# Altium schematic sheet ISL6236A_DEMO.SchDoc (part 2 of 2)
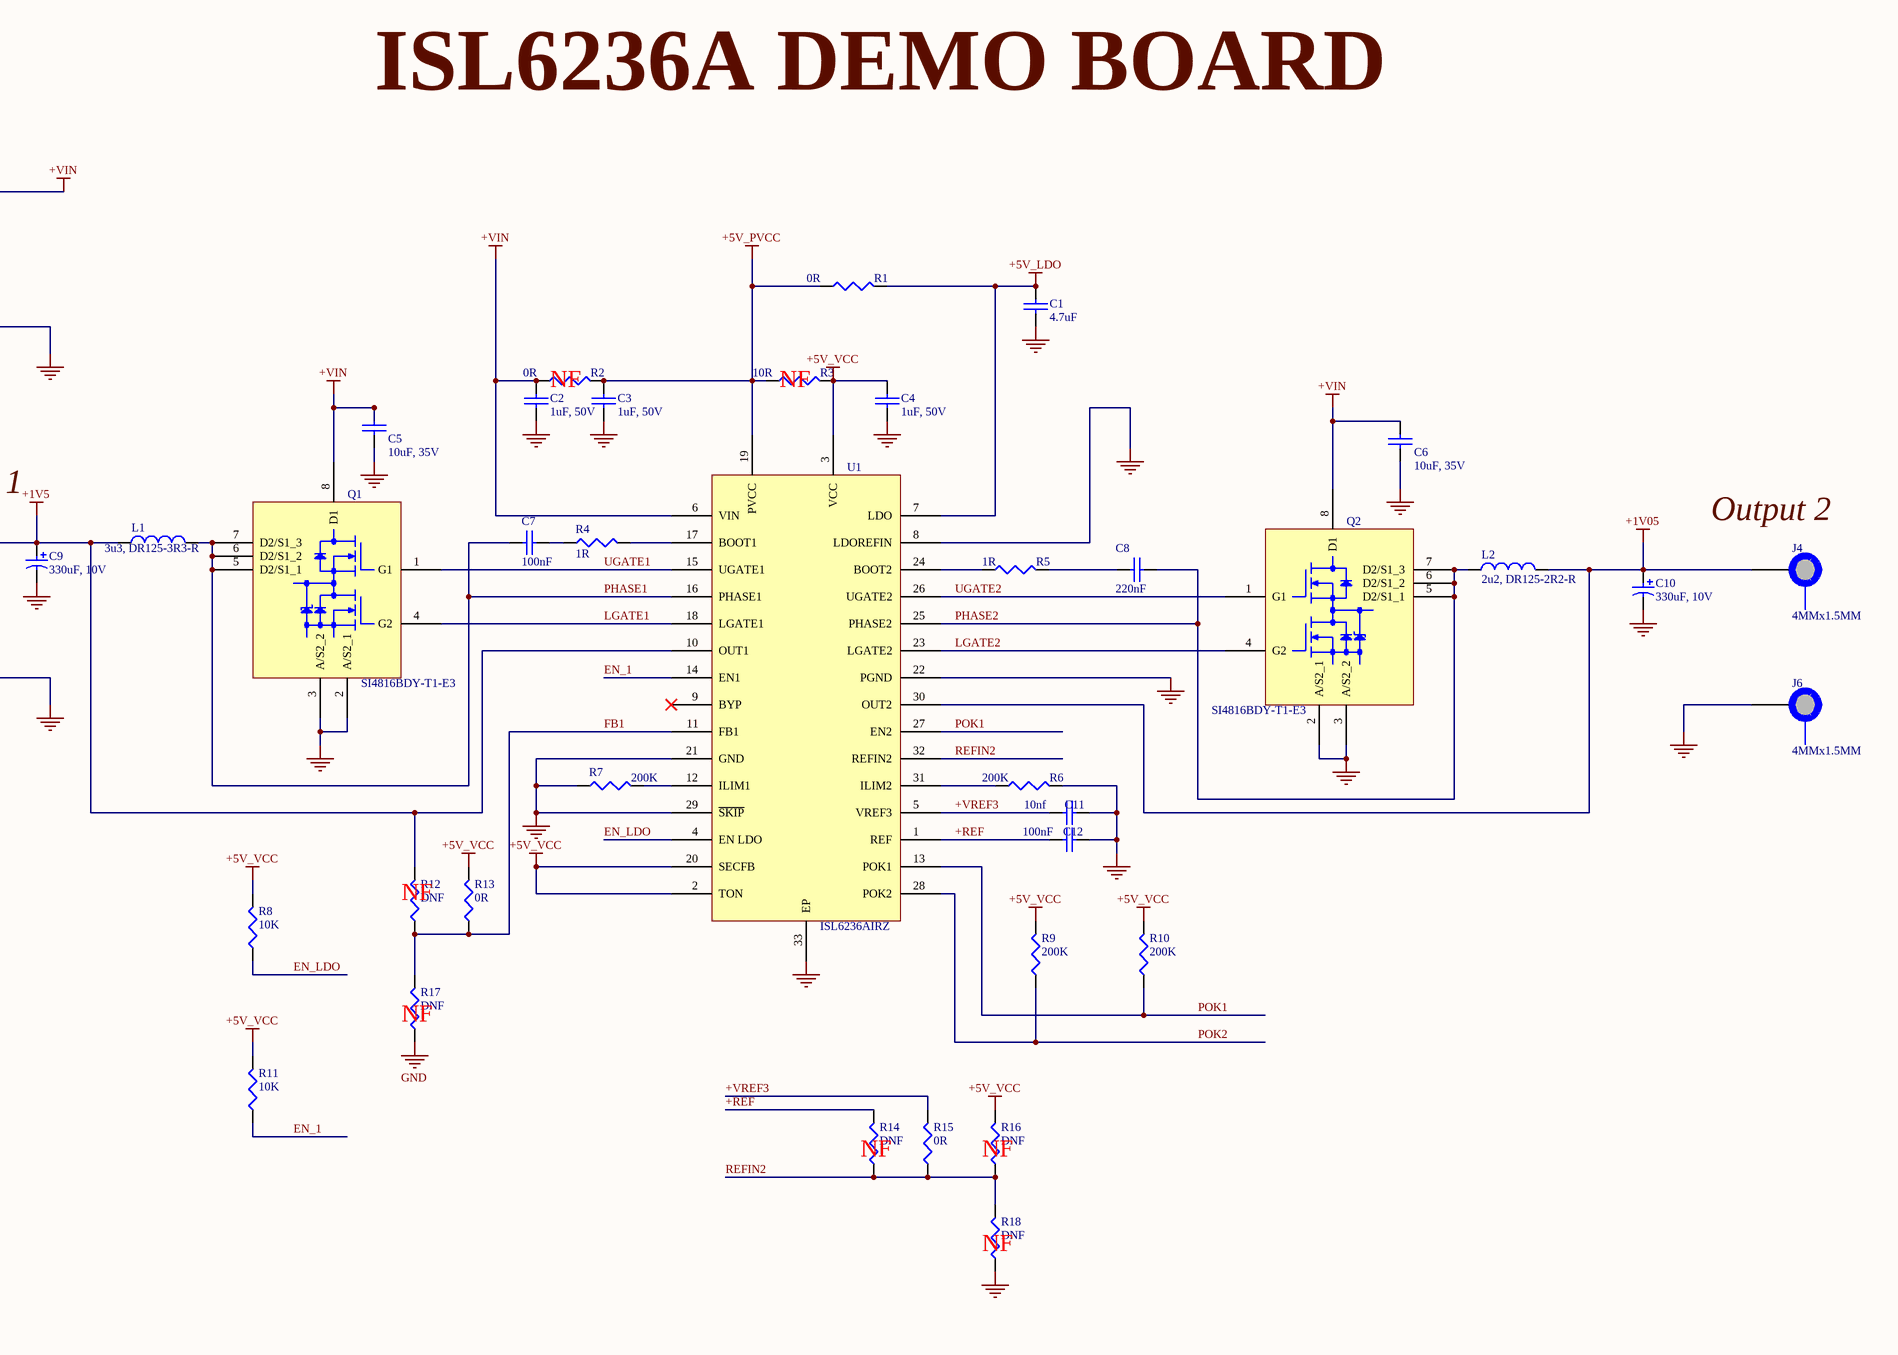
[diagram p2: ISL6236A_DEMO.SchDoc, right]

## Library data of the parts (continued)
L2 = DR125-2R2-R: Inductor Power Shielded Drum Core 2.2uH 20% 100KHz Ferrite 10.9A 4.5mOhm DCR T/R; Manufacturer: Eaton; DC Resistance (DCR): 4.5mΩ; Value: 2.2µH; Number of Circuits: 1; Saturation Current: 15A; Supplier: DigiKey; Supplier Part Number: 513-1662-1-ND; Manufacturer Part Number: DR125-2R2-R; RoHS: Compliant; Category: Fixed Inductors; Stock: 226; Pricing: 1=0.83, 10=0.685, 100=0.563 (USD); Case/Package: Nonstandard; China RoHS: Compliant; Composition: Wirewound; Core Material: Ferrite; Country of Origin: Philippines; Current Rating: 10.9A; DC Current: 10.9A; Depth: 12.5mm; Export Control Classification Number (ECCN) Code: EAR99; Height: 6mm; Height - Seated (Max): 5.9944mm; Harmonized Tariff Schedule (HTS) Code: 8504.50.80.00; Inductance Tolerance: 20%; Introduction Date: 2005-07-20; Lead Free: Lead Free; Length: 12.5mm; Lifecycle Status: Production; Max Current Rating: 10.9A; Max DC Current: 10.9A; Max Operating Temperature: 125°C; Military Standard: Not; Min Operating Temperature: -40°C; Mounting Technology: Surface Mount; Pins: 2; Number of Terminals: 2; Packaging: Cut Tape; Radiation Hardening: No; REACH SVHC: No; RMS Current (Irms): 10.9A; Self Resonant Frequency: 100kHz; Shielding: Shielded; Termination: SMD/SMT; Test Frequency: 100kHz; Tolerance: 20%; Weight: 4.082331g; Width: 12.5mm; ComponentLink1URL: https://datasheet.octopart.com:443/DR125-2R2-R-Eaton-datasheet-129252529.pdf?src-supplier=Electro+Sonic; ComponentLink1Description: https://datasheet.octopart.com:443/DR125-2R2-R-Eaton-datasheet-129252529.pdf?src-supplier=Electro+Sonic; ComponentLink2URL: https://datasheet.octopart.com:443/DR125-2R2-R-Eaton-datasheet-41175520.pdf?src-supplier=Master+Electronics; ComponentLink2Description: https://datasheet.octopart.com:443/DR125-2R2-R-Eaton-datasheet-41175520.pdf?src-supplier=Master+Electronics; ComponentLink3URL: https://datasheet.octopart.com:443/DR125-2R2-R-Coiltronics-datasheet-8612520.pdf?src-supplier=IHS; ComponentLink3Description: https://datasheet.octopart.com:443/DR125-2R2-R-Coiltronics-datasheet-8612520.pdf?src-supplier=IHS; ComponentLink4URL: https://datasheet.octopart.com:443/DR125-2R2-R-Eaton-datasheet-552538.pdf?src-supplier=Newark; ComponentLink4Description: https://datasheet.octopart.com:443/DR125-2R2-R-Eaton-datasheet-552538.pdf?src-supplier=Newark; ComponentLink5URL: https://datasheet.octopart.com:443/DR125-2R2-R-Coiltronics-datasheet-3395.pdf?src-supplier=Factory+Futures; ComponentLink5Description: https://datasheet.octopart.com:443/DR125-2R2-R-Coiltronics-datasheet-3395.pdf?src-supplier=Factory+Futures; ComponentLink6URL: https://datasheet.octopart.com:443/DR125-2R2-R-Eaton-datasheet-37490916.pdf?src-supplier=RS+(Formerly+Allied+Electronics); ComponentLink6Description: https://datasheet.octopart.com:443/DR125-2R2-R-Eaton-datasheet-37490916.pdf?src-supplier=RS+(Formerly+Allied+Electronics); ComponentLink7URL: https://datasheet.octopart.com:443/DR125-2R2-R-Coiltronics-datasheet-119352.pdf?src-supplier=DigiKey; ComponentLink7Description: https://datasheet.octopart.com:443/DR125-2R2-R-Coiltronics-datasheet-119352.pdf?src-supplier=DigiKey
Q1 Q2 = SI4816BDY-T1-E3: Transistor MOSFET Array Dual N-CH 30V 5.8A/8.2A 8-Pin SOIC T/R; Manufacturer: Vishay; Continuous Drain Current (ID): 5.8A; Drain to Source Resistance: 18.5mΩ; Element Configuration: Single; Fall Time: 9ns; Gate to Source Voltage (Vgs): 20V; Max Junction Temperature (Tj): 150°C; Max Power Dissipation: 1W; Nominal Vgs: 3V; Number of Channels: 2; Value: 18.5mΩ; Threshold Voltage: 1V; Turn-Off Delay Time: 31ns; Turn-On Delay Time: 13ns; Supplier: DigiKey; Supplier Part Number: SI4816BDY-T1-E3CT-ND; Manufacturer Part Number: SI4816BDY-T1-E3; RoHS: Compliant; Category: MOSFETs; Stock: 2831; Pricing: 1=2.53, 10=1.627, 100=1.1094, 500=0.88782, 1000=0.81657 (USD); Case/Package: SO; China RoHS: Compliant; Drain to Source Voltage (Vdss): 30V; Export Control Classification Number (ECCN) Code: EAR99; Height: 1.75mm; Introduction Date: 2004-10-28; Lead Free: Lead Free; Length: 5mm; Lifecycle Status: Production; Max Operating Temperature: 150°C; Min Breakdown Voltage: 30V; Min Operating Temperature: -55°C; Mounting Technology: Surface Mount; Number of Elements: 2; Pins: 8; Number of Terminals: 8; Radiation Hardening: No; Rds On Max: 18.5mΩ; REACH SVHC: Yes; Rise Time: 9ns; Schedule B: 8541290080, 8541290080|8541290080|8541290080|8541290080|8541290080; Weight: 186.993455mg; Width: 4mm; ComponentLink1URL: https://datasheet.octopart.com:443/SI4816BDY-T1-E3-Vishay-datasheet-181471835.pdf?src-supplier=Farnell; ComponentLink1Description: https://datasheet.octopart.com:443/SI4816BDY-T1-E3-Vishay-datasheet-181471835.pdf?src-supplier=Farnell; ComponentLink2URL: https://datasheet.octopart.com:443/SI4816BDY-T1-E3-Vishay-datasheet-8703106.pdf?src-supplier=element14+APAC; ComponentLink2Description: https://datasheet.octopart.com:443/SI4816BDY-T1-E3-Vishay-datasheet-8703106.pdf?src-supplier=element14+APAC; ComponentLink3URL: https://datasheet.octopart.com:443/SI4816BDY-T1-E3-Vishay-datasheet-11047461.pdf?src-supplier=element14+APAC; ComponentLink3Description: https://datasheet.octopart.com:443/SI4816BDY-T1-E3-Vishay-datasheet-11047461.pdf?src-supplier=element14+APAC; ComponentLink4URL: https://datasheet.octopart.com:443/SI4816BDY-T1-E3-Vishay-datasheet-8332786.pdf?src-supplier=element14+APAC; ComponentLink4Description: https://datasheet.octopart.com:443/SI4816BDY-T1-E3-Vishay-datasheet-8332786.pdf?src-supplier=element14+APAC; ComponentLink5URL: https://datasheet.octopart.com:443/SI4816BDY-T1-E3-Vishay-datasheet-31978687.pdf?src-supplier=element14+APAC; ComponentLink5Description: https://datasheet.octopart.com:443/SI4816BDY-T1-E3-Vishay-datasheet-31978687.pdf?src-supplier=element14+APAC; ComponentLink6URL: https://datasheet.octopart.com:443/SI4816BDY-T1-E3-Vishay-datasheet-181482347.pdf?src-supplier=IHS; ComponentLink6Description: https://datasheet.octopart.com:443/SI4816BDY-T1-E3-Vishay-datasheet-181482347.pdf?src-supplier=IHS; ComponentLink7URL: https://datasheet.octopart.com:443/SI4816BDY-T1-E3-Vishay-datasheet-62318721.pdf?src-supplier=Newark; ComponentLink7Description: https://datasheet.octopart.com:443/SI4816BDY-T1-E3-Vishay-datasheet-62318721.pdf?src-supplier=Newark; ComponentLink8URL: https://datasheet.octopart.com:443/SI4816BDY-T1-E3-Vishay-datasheet-41341409.pdf?src-supplier=Newark; ComponentLink8Description: https://datasheet.octopart.com:443/SI4816BDY-T1-E3-Vishay-datasheet-41341409.pdf?src-supplier=Newark; ComponentLink9URL: https://datasheet.octopart.com:443/SI4816BDY-T1-E3-Vishay-datasheet-141196160.pdf?src-supplier=TME; ComponentLink9Description: https://datasheet.octopart.com:443/SI4816BDY-T1-E3-Vishay-datasheet-141196160.pdf?src-supplier=TME; ComponentLink10URL: https://datasheet.octopart.com:443/SI4816BDY-T1-E3-Vishay-datasheet-14187004.pdf?src-supplier=iiiC; ComponentLink10Description: https://datasheet.octopart.com:443/SI4816BDY-T1-E3-Vishay-datasheet-14187004.pdf?src-supplier=iiiC; ComponentLink11URL: https://datasheet.octopart.com:443/SI4816BDY-T1-E3-Vishay-datasheet-11890201.pdf?src-supplier=Arrow+Electronics; ComponentLink11Description: https://datasheet.octopart.com:443/SI4816BDY-T1-E3-Vishay-datasheet-11890201.pdf?src-supplier=Arrow+Electronics; ComponentLink12URL: http://sigma.octopart.com:80/rohs_statement/Vishay-company-15.pdf?src-supplier=Compliance+Statements; ComponentLink12Description: http://sigma.octopart.com:80/rohs_statement/Vishay-company-15.pdf?src-supplier=Compliance+Statements
R1 R2 R13 R15 = AC0805JR-070RL: Zero Ohm Resistor, Jumper, 0805 [2012 Metric], Thick Film, 125 mW, 2 A, Surface Mount Device; Manufacturer: Yageo Group; Manufacturer Package Identifier: 0805 (2012 metric); Max Power Dissipation: 125mW; Value: 0Ω; Temperature Coefficient: 200ppm/°C; Tolerance: 5%; Voltage Rating: 150V; Supplier: DigiKey; Supplier Part Number: YAG3755CT-ND; Manufacturer Part Number: AC0805JR-070RL; RoHS: Compliant; Category: Chip SMD Resistors; Stock: 218115; Pricing: 1=0.1, 10=0.019, 25=0.016, 50=0.0138, 100=0.0121, 250=0.01024, 500=0.00902, 1000=0.008 (USD); Case/Package: 0805; Case Code (Imperial): 0805; Case Code (Metric): 2012; China RoHS: Non-Compliant; Composition: Thick Film; Features: Automotive AEC-Q200, Moisture Resistant; Height: 500µm; Lead Free: Lead Free; Length: 2mm; Lifecycle Status: Production; Max Operating Temperature: 155°C; Min Operating Temperature: -55°C; Mounting Technology: Surface Mount; Number of Terminals: 2; Number of Terminations: 2; Packaging: Tape & Reel; Power Rating: 125mW; Ratings: AEC-Q200; REACH SVHC: Yes; Termination: SMD/SMT; Width: 1.25mm; ComponentLink1URL: https://datasheet.octopart.com:443/AC0805JR-070RL-Yageo-datasheet-176385416.pdf?src-supplier=IHS; ComponentLink1Description: https://datasheet.octopart.com:443/AC0805JR-070RL-Yageo-datasheet-176385416.pdf?src-supplier=IHS; ComponentLink2URL: https://datasheet.octopart.com:443/AC0805JR-070RL-Yageo-datasheet-151884373.pdf?src-supplier=Future+Electronics; ComponentLink2Description: https://datasheet.octopart.com:443/AC0805JR-070RL-Yageo-datasheet-151884373.pdf?src-supplier=Future+Electronics; ComponentLink3URL: https://datasheet.octopart.com:443/AC0805JR-070RL-Yageo-datasheet-166720450.pdf?src-supplier=Future+Electronics; ComponentLink3Description: https://datasheet.octopart.com:443/AC0805JR-070RL-Yageo-datasheet-166720450.pdf?src-supplier=Future+Electronics; ComponentLink4URL: https://datasheet.octopart.com:443/AC0805JR-070RL-Yageo-datasheet-137699919.pdf?src-supplier=Future+Electronics; ComponentLink4Description: https://datasheet.octopart.com:443/AC0805JR-070RL-Yageo-datasheet-137699919.pdf?src-supplier=Future+Electronics; ComponentLink5URL: https://datasheet.octopart.com:443/AC0805JR-070RL-Yageo-datasheet-83209224.pdf?src-supplier=Future+Electronics; ComponentLink5Description: https://datasheet.octopart.com:443/AC0805JR-070RL-Yageo-datasheet-83209224.pdf?src-supplier=Future+Electronics; ComponentLink6URL: https://datasheet.octopart.com:443/AC0805JR-070RL-Yageo-datasheet-62139191.pdf?src-supplier=Future+Electronics; ComponentLink6Description: https://datasheet.octopart.com:443/AC0805JR-070RL-Yageo-datasheet-62139191.pdf?src-supplier=Future+Electronics; ComponentLink7URL: https://sigma.octopart.com:443/138820526/technical_drawing/Yageo-AC0805JR-070RL.pdf?src-supplier=Upverter; ComponentLink7Description: https://sigma.octopart.com:443/138820526/technical_drawing/Yageo-AC0805JR-070RL.pdf?src-supplier=Upverter; ComponentLink8URL: https://datasheet.octopart.com:443/AC0805JR-070RL-Yageo-Group-datasheet-164768995.pdf?src-supplier=ODG+(Origin+Data+Global); ComponentLink8Description: https://datasheet.octopart.com:443/AC0805JR-070RL-Yageo-Group-datasheet-164768995.pdf?src-supplier=ODG+(Origin+Data+Global); ComponentLink9URL: https://datasheet.octopart.com/AC0805JR-070RL-Yageo-datasheet-12512238.pdf; ComponentLink9Description: https://datasheet.octopart.com/AC0805JR-070RL-Yageo-datasheet-12512238.pdf; ComponentLink10URL: https://datasheet.octopart.com:443/AC0805JR-070RL-Yageo-Group-datasheet-190384202.pdf?src-supplier=Farnell; ComponentLink10Description: https://datasheet.octopart.com:443/AC0805JR-070RL-Yageo-Group-datasheet-190384202.pdf?src-supplier=Farnell; ComponentLink11URL: http://sigma.octopart.com:80/conflict_mineral_statement/Yageo-company-3.pdf?src-supplier=Compliance+Statements; ComponentLink11Description: http://sigma.octopart.com:80/conflict_mineral_statement/Yageo-company-3.pdf?src-supplier=Compliance+Statements; ComponentLink12URL: http://sigma.octopart.com:80/rohs_statement/Yageo-company-2.pdf?src-supplier=Compliance+Statements; ComponentLink12Description: http://sigma.octopart.com:80/rohs_statement/Yageo-company-2.pdf?src-supplier=Compliance+Statements
R3 = AC0805FR-1310RL: Res Thick Film 0805 10 Ohm 1% 0.125W(1/8W) ±100ppm/C Pad SMD T/R Automotive AEC-Q200; Manufacturer: Yageo Group; Power Rating: 125mW; Value: 10Ω; Temperature Coefficient: 100ppm/°C; Voltage Rating: 150V; Supplier: DigiKey; Supplier Part Number: 13-AC0805FR-1310RLDKR-ND; Manufacturer Part Number: AC0805FR-1310RL; RoHS: Compliant; Category: Chip SMD Resistors; Stock: 19780; Pricing: 1=0.12, 10=0.055, 25=0.042, 50=0.035, 100=0.0293, 250=0.02368, 500=0.02046, 1000=0.01791, 5000=0.01387 (USD); Case/Package: 0805; China RoHS: Non-Compliant; Composition: Thick Film; Country of Origin: Mainland China, Taiwan; Export Control Classification Number (ECCN) Code: EAR99; Height: 500µm; Harmonized Tariff Schedule (HTS) Code: 8533.21.00.30; Introduction Date: 2012-04-10; Length: 2mm; Lifecycle Status: Production; Max Operating Temperature: 155°C; Min Operating Temperature: -55°C; Mounting Technology: Surface Mount; Number of Terminals: 2; Packaging: Tape & Reel; Ratings: AEC-Q200; REACH SVHC: Yes; Tolerance: 1%; Width: 1.25mm; Working Voltage: 150V; ComponentLink1URL: https://datasheet.octopart.com:443/AC0805FR-1310RL-Yageo-datasheet-182189377.pdf?src-supplier=IHS; ComponentLink1Description: https://datasheet.octopart.com:443/AC0805FR-1310RL-Yageo-datasheet-182189377.pdf?src-supplier=IHS; ComponentLink2URL: https://datasheet.octopart.com:443/AC0805FR-1310RL-Yageo-datasheet-83209224.pdf?src-supplier=Upverter; ComponentLink2Description: https://datasheet.octopart.com:443/AC0805FR-1310RL-Yageo-datasheet-83209224.pdf?src-supplier=Upverter; ComponentLink3URL: https://datasheet.octopart.com/AC0805FR-1310RL-Yageo-datasheet-12512238.pdf; ComponentLink3Description: https://datasheet.octopart.com/AC0805FR-1310RL-Yageo-datasheet-12512238.pdf; ComponentLink4URL: http://sigma.octopart.com:80/conflict_mineral_statement/Yageo-company-3.pdf?src-supplier=Compliance+Statements; ComponentLink4Description: http://sigma.octopart.com:80/conflict_mineral_statement/Yageo-company-3.pdf?src-supplier=Compliance+Statements; ComponentLink5URL: http://sigma.octopart.com:80/rohs_statement/Yageo-company-2.pdf?src-supplier=Compliance+Statements; ComponentLink5Description: http://sigma.octopart.com:80/rohs_statement/Yageo-company-2.pdf?src-supplier=Compliance+Statements
R4 R5 = AC0805FR-071RL: Res Thick Film 0805 1 Ohm 1% 0.125W(1/8W) ±200ppm/C Pad SMD T/R Automotive AEC-Q200; Manufacturer: Yageo Group; Manufacturer Package Identifier: 0805 (2012 metric); Max Power Dissipation: 125mW; Value: 1Ω; Temperature Coefficient: 200ppm/°C; Voltage Rating: 150V; Supplier: DigiKey; Supplier Part Number: YAG3705CT-ND; Manufacturer Part Number: AC0805FR-071RL; RoHS: Compliant; Category: Chip SMD Resistors; Stock: 493; Pricing: 1=0.12, 10=0.055, 25=0.042, 50=0.035, 100=0.0293, 250=0.02368, 500=0.02046, 1000=0.01791 (USD); Case/Package: 0805; Case Code (Imperial): 0805; Case Code (Metric): 2012; China RoHS: Non-Compliant; Composition: Thick Film; Features: Automotive AEC-Q200, Moisture Resistant; Height: 500µm; Lead Free: Lead Free; Length: 2mm; Lifecycle Status: Production; Max Operating Temperature: 155°C; Min Operating Temperature: -55°C; Mounting Technology: Surface Mount; Number of Terminals: 2; Number of Terminations: 2; Packaging: Tape & Reel; Power Rating: 125mW; Ratings: AEC-Q200; REACH SVHC: Yes; Schedule B: 8533210045, 8533210045|8533210045|8533210045|8533210045|8533210045; Termination: SMD/SMT; Tolerance: 1%; Weight: 5.499807mg; Width: 1.25mm; Working Voltage: 150V; ComponentLink1URL: https://datasheet.octopart.com:443/AC0805FR-071RL-Yageo-datasheet-182189377.pdf?src-supplier=IHS; ComponentLink1Description: https://datasheet.octopart.com:443/AC0805FR-071RL-Yageo-datasheet-182189377.pdf?src-supplier=IHS; ComponentLink2URL: https://datasheet.octopart.com:443/AC0805FR-071RL-Yageo-datasheet-178509465.pdf?src-supplier=Newark; ComponentLink2Description: https://datasheet.octopart.com:443/AC0805FR-071RL-Yageo-datasheet-178509465.pdf?src-supplier=Newark; ComponentLink3URL: https://datasheet.octopart.com:443/AC0805FR-071RL-Yageo-datasheet-166720450.pdf?src-supplier=JRH+Electronics; ComponentLink3Description: https://datasheet.octopart.com:443/AC0805FR-071RL-Yageo-datasheet-166720450.pdf?src-supplier=JRH+Electronics; ComponentLink4URL: https://datasheet.octopart.com/AC0805FR-071RL-Yageo-datasheet-12512238.pdf; ComponentLink4Description: https://datasheet.octopart.com/AC0805FR-071RL-Yageo-datasheet-12512238.pdf; ComponentLink5URL: https://datasheet.octopart.com:443/AC0805FR-071RL-Yageo-Group-datasheet-188689268.pdf?src-supplier=TME; ComponentLink5Description: https://datasheet.octopart.com:443/AC0805FR-071RL-Yageo-Group-datasheet-188689268.pdf?src-supplier=TME; ComponentLink6URL: https://datasheet.octopart.com:443/AC0805FR-071RL-Yageo-Group-datasheet-164768995.pdf?src-supplier=ODG+(Origin+Data+Global); ComponentLink6Description: https://datasheet.octopart.com:443/AC0805FR-071RL-Yageo-Group-datasheet-164768995.pdf?src-supplier=ODG+(Origin+Data+Global); ComponentLink7URL: https://datasheet.octopart.com:443/AC0805FR-071RL-Yageo-datasheet-151884373.pdf?src-supplier=Future+Electronics; ComponentLink7Description: https://datasheet.octopart.com:443/AC0805FR-071RL-Yageo-datasheet-151884373.pdf?src-supplier=Future+Electronics; ComponentLink8URL: https://datasheet.octopart.com:443/AC0805FR-071RL-Yageo-datasheet-137699919.pdf?src-supplier=Future+Electronics; ComponentLink8Description: https://datasheet.octopart.com:443/AC0805FR-071RL-Yageo-datasheet-137699919.pdf?src-supplier=Future+Electronics; ComponentLink9URL: https://datasheet.octopart.com:443/AC0805FR-071RL-Yageo-datasheet-24580492.pdf?src-supplier=Future+Electronics; ComponentLink9Description: https://datasheet.octopart.com:443/AC0805FR-071RL-Yageo-datasheet-24580492.pdf?src-supplier=Future+Electronics; ComponentLink10URL: https://datasheet.octopart.com:443/AC0805FR-071RL-Yageo-datasheet-13029202.pdf?src-supplier=Future+Electronics; ComponentLink10Description: https://datasheet.octopart.com:443/AC0805FR-071RL-Yageo-datasheet-13029202.pdf?src-supplier=Future+Electronics; ComponentLink11URL: http://sigma.octopart.com:80/conflict_mineral_statement/Yageo-company-3.pdf?src-supplier=Compliance+Statements; ComponentLink11Description: http://sigma.octopart.com:80/conflict_mineral_statement/Yageo-company-3.pdf?src-supplier=Compliance+Statements; ComponentLink12URL: http://sigma.octopart.com:80/rohs_statement/Yageo-company-2.pdf?src-supplier=Compliance+Statements; ComponentLink12Description: http://sigma.octopart.com:80/rohs_statement/Yageo-company-2.pdf?src-supplier=Compliance+Statements
R6 R7 R9 R10 = AC0805FR-07200KL: Res Thick Film 0805 200K Ohm 1% 0.125W(1/8W) ±100ppm/C Pad SMD T/R Automotive AEC-Q200; Manufacturer: Yageo Group; Manufacturer Package Identifier: 0805 (2012 metric); Max Power Dissipation: 125mW; Value: 200kΩ; Temperature Coefficient: 100ppm/°C; Voltage Rating: 150V; Supplier: DigiKey; Supplier Part Number: YAG3706CT-ND; Manufacturer Part Number: AC0805FR-07200KL; RoHS: Compliant; Category: Chip SMD Resistors; Stock: 42266; Pricing: 1=0.1, 10=0.037, 25=0.028, 50=0.0228, 100=0.0188, 250=0.01484, 500=0.0126, 1000=0.01083 (USD); Case/Package: 0805; Case Code (Imperial): 0805; Case Code (Metric): 2012; China RoHS: Non-Compliant; Composition: Thick Film; Features: Automotive AEC-Q200, Moisture Resistant; Height: 500µm; Lead Free: Lead Free; Length: 2mm; Lifecycle Status: Production; Max Operating Temperature: 155°C; Min Operating Temperature: -55°C; Mounting Technology: Surface Mount; Number of Terminals: 2; Number of Terminations: 2; Packaging: Tape & Reel; Power Rating: 125mW; Ratings: AEC-Q200; REACH SVHC: Yes; Schedule B: 8533210045, 8533210045|8533210045|8533210045|8533210045|8533210045; Termination: SMD/SMT; Tolerance: 1%; Width: 1.25mm; Working Voltage: 150V; ComponentLink1URL: https://datasheet.octopart.com:443/AC0805FR-07200KL-Yageo-datasheet-182189377.pdf?src-supplier=IHS; ComponentLink1Description: https://datasheet.octopart.com:443/AC0805FR-07200KL-Yageo-datasheet-182189377.pdf?src-supplier=IHS; ComponentLink2URL: https://datasheet.octopart.com:443/AC0805FR-07200KL-Yageo-datasheet-83209224.pdf?src-supplier=Upverter; ComponentLink2Description: https://datasheet.octopart.com:443/AC0805FR-07200KL-Yageo-datasheet-83209224.pdf?src-supplier=Upverter; ComponentLink3URL: https://datasheet.octopart.com:443/AC0805FR-07200KL-Yageo-datasheet-178509465.pdf?src-supplier=Farnell; ComponentLink3Description: https://datasheet.octopart.com:443/AC0805FR-07200KL-Yageo-datasheet-178509465.pdf?src-supplier=Farnell; ComponentLink4URL: https://datasheet.octopart.com/AC0805FR-07200KL-Yageo-datasheet-12512238.pdf; ComponentLink4Description: https://datasheet.octopart.com/AC0805FR-07200KL-Yageo-datasheet-12512238.pdf; ComponentLink5URL: https://datasheet.octopart.com:443/AC0805FR-07200KL-Yageo-Group-datasheet-193561750.pdf?src-supplier=element14+APAC; ComponentLink5Description: https://datasheet.octopart.com:443/AC0805FR-07200KL-Yageo-Group-datasheet-193561750.pdf?src-supplier=element14+APAC; ComponentLink6URL: https://datasheet.octopart.com:443/AC0805FR-07200KL-Yageo-datasheet-166720450.pdf?src-supplier=Future+Electronics; ComponentLink6Description: https://datasheet.octopart.com:443/AC0805FR-07200KL-Yageo-datasheet-166720450.pdf?src-supplier=Future+Electronics; ComponentLink7URL: https://datasheet.octopart.com:443/AC0805FR-07200KL-Yageo-datasheet-151884373.pdf?src-supplier=Future+Electronics; ComponentLink7Description: https://datasheet.octopart.com:443/AC0805FR-07200KL-Yageo-datasheet-151884373.pdf?src-supplier=Future+Electronics; ComponentLink8URL: https://datasheet.octopart.com:443/AC0805FR-07200KL-Yageo-datasheet-137699919.pdf?src-supplier=Future+Electronics; ComponentLink8Description: https://datasheet.octopart.com:443/AC0805FR-07200KL-Yageo-datasheet-137699919.pdf?src-supplier=Future+Electronics; ComponentLink9URL: https://datasheet.octopart.com:443/AC0805FR-07200KL-Yageo-datasheet-24580492.pdf?src-supplier=Future+Electronics; ComponentLink9Description: https://datasheet.octopart.com:443/AC0805FR-07200KL-Yageo-datasheet-24580492.pdf?src-supplier=Future+Electronics; ComponentLink10URL: https://datasheet.octopart.com:443/AC0805FR-07200KL-Yageo-datasheet-13029202.pdf?src-supplier=Future+Electronics; ComponentLink10Description: https://datasheet.octopart.com:443/AC0805FR-07200KL-Yageo-datasheet-13029202.pdf?src-supplier=Future+Electronics; ComponentLink11URL: https://datasheet.octopart.com:443/AC0805FR-07200KL-Yageo-Group-datasheet-164768995.pdf?src-supplier=ODG+(Origin+Data+Global); ComponentLink11Description: https://datasheet.octopart.com:443/AC0805FR-07200KL-Yageo-Group-datasheet-164768995.pdf?src-supplier=ODG+(Origin+Data+Global); ComponentLink12URL: https://datasheet.octopart.com:443/AC0805FR-07200KL-Yageo-datasheet-140571090.pdf?src-supplier=Arrow.cn; ComponentLink12Description: https://datasheet.octopart.com:443/AC0805FR-07200KL-Yageo-datasheet-140571090.pdf?src-supplier=Arrow.cn; ComponentLink13URL: http://sigma.octopart.com:80/conflict_mineral_statement/Yageo-company-3.pdf?src-supplier=Compliance+Statements; ComponentLink13Description: http://sigma.octopart.com:80/conflict_mineral_statement/Yageo-company-3.pdf?src-supplier=Compliance+Statements; ComponentLink14URL: http://sigma.octopart.com:80/rohs_statement/Yageo-company-2.pdf?src-supplier=Compliance+Statements; ComponentLink14Description: http://sigma.octopart.com:80/rohs_statement/Yageo-company-2.pdf?src-supplier=Compliance+Statements
R8 R11 = AC0805FR-0710KL: Res Thick Film 0805 10K Ohm 1% 0.125W(1/8W) ±100ppm/C Pad SMD Automotive T/R; Manufacturer: Yageo Group; Max Power Dissipation: 125mW; Value: 10kΩ; Temperature Coefficient: 100ppm/°C; Voltage Rating: 150V; Supplier: DigiKey; Supplier Part Number: 311-10KLGCT-ND; Manufacturer Part Number: AC0805FR-0710KL; RoHS: Compliant; Category: Chip SMD Resistors; Stock: 179739; Pricing: 1=0.1, 10=0.037, 25=0.028, 50=0.0228, 100=0.0188, 250=0.01484, 500=0.0126, 1000=0.01083 (USD); Case/Package: 0805; Case Code (Imperial): 0805; Case Code (Metric): 2012; China RoHS: Non-Compliant; Composition: Thick Film; Depth: 1.25mm; Features: Anti-Sulfur, Automotive AEC-Q200, Moisture Resistant; Height: 500µm; Lead Free: Lead Free; Length: 2mm; Lifecycle Status: Production; Max Operating Temperature: 155°C; Military Standard: Not; Min Operating Temperature: -55°C; Mounting Technology: Surface Mount; Number of Terminals: 2; Number of Terminations: 2; Packaging: Tape & Reel; Power Rating: 125mW; Ratings: AEC-Q200; REACH SVHC: Yes; Schedule B: 8533210045, 8533210045|8533210045, 8533210045|8533210045|8533210045, 8533210045|8533210045|8533210045|8533210045; Termination: SMD/SMT; Tolerance: 1%; Width: 1.25mm; Working Voltage: 150V; ComponentLink1URL: https://datasheet.octopart.com:443/AC0805FR-0710KL-Yageo-datasheet-182189377.pdf?src-supplier=IHS; ComponentLink1Description: https://datasheet.octopart.com:443/AC0805FR-0710KL-Yageo-datasheet-182189377.pdf?src-supplier=IHS; ComponentLink2URL: https://datasheet.octopart.com:443/AC0805FR-0710KL-Yageo-datasheet-83209224.pdf?src-supplier=Upverter; ComponentLink2Description: https://datasheet.octopart.com:443/AC0805FR-0710KL-Yageo-datasheet-83209224.pdf?src-supplier=Upverter; ComponentLink3URL: https://datasheet.octopart.com:443/AC0805FR-0710KL-Yageo-datasheet-178509465.pdf?src-supplier=Newark; ComponentLink3Description: https://datasheet.octopart.com:443/AC0805FR-0710KL-Yageo-datasheet-178509465.pdf?src-supplier=Newark; ComponentLink4URL: https://datasheet.octopart.com/AC0805FR-0710KL-Yageo-datasheet-12512238.pdf; ComponentLink4Description: https://datasheet.octopart.com/AC0805FR-0710KL-Yageo-datasheet-12512238.pdf; ComponentLink5URL: https://datasheet.octopart.com:443/AC0805FR-0710KL-Yageo-datasheet-166720450.pdf?src-supplier=Future+Electronics; ComponentLink5Description: https://datasheet.octopart.com:443/AC0805FR-0710KL-Yageo-datasheet-166720450.pdf?src-supplier=Future+Electronics; ComponentLink6URL: https://datasheet.octopart.com:443/AC0805FR-0710KL-Yageo-datasheet-151884373.pdf?src-supplier=Future+Electronics; ComponentLink6Description: https://datasheet.octopart.com:443/AC0805FR-0710KL-Yageo-datasheet-151884373.pdf?src-supplier=Future+Electronics; ComponentLink7URL: https://datasheet.octopart.com:443/AC0805FR-0710KL-Yageo-datasheet-137699919.pdf?src-supplier=Future+Electronics; ComponentLink7Description: https://datasheet.octopart.com:443/AC0805FR-0710KL-Yageo-datasheet-137699919.pdf?src-supplier=Future+Electronics; ComponentLink8URL: https://datasheet.octopart.com:443/AC0805FR-0710KL-Yageo-datasheet-24580492.pdf?src-supplier=Future+Electronics; ComponentLink8Description: https://datasheet.octopart.com:443/AC0805FR-0710KL-Yageo-datasheet-24580492.pdf?src-supplier=Future+Electronics; ComponentLink9URL: https://datasheet.octopart.com:443/AC0805FR-0710KL-Yageo-datasheet-13029202.pdf?src-supplier=Future+Electronics; ComponentLink9Description: https://datasheet.octopart.com:443/AC0805FR-0710KL-Yageo-datasheet-13029202.pdf?src-supplier=Future+Electronics; ComponentLink10URL: https://datasheet.octopart.com:443/AC0805FR-0710KL-Yageo-Group-datasheet-164768995.pdf?src-supplier=ODG+(Origin+Data+Global); ComponentLink10Description: https://datasheet.octopart.com:443/AC0805FR-0710KL-Yageo-Group-datasheet-164768995.pdf?src-supplier=ODG+(Origin+Data+Global); ComponentLink11URL: https://datasheet.octopart.com:443/AC0805FR-0710KL-Yageo-datasheet-159083007.pdf?src-supplier=TME; ComponentLink11Description: https://datasheet.octopart.com:443/AC0805FR-0710KL-Yageo-datasheet-159083007.pdf?src-supplier=TME; ComponentLink12URL: https://datasheet.octopart.com:443/AC0805FR-0710KL-Yageo-datasheet-128680559.pdf?src-supplier=X-ON; ComponentLink12Description: https://datasheet.octopart.com:443/AC0805FR-0710KL-Yageo-datasheet-128680559.pdf?src-supplier=X-ON; ComponentLink13URL: https://datasheet.octopart.com:443/AC0805FR-0710KL-Yageo-datasheet-140571090.pdf?src-supplier=Arrow.cn; ComponentLink13Description: https://datasheet.octopart.com:443/AC0805FR-0710KL-Yageo-datasheet-140571090.pdf?src-supplier=Arrow.cn; ComponentLink14URL: http://sigma.octopart.com:80/conflict_mineral_statement/Yageo-company-3.pdf?src-supplier=Compliance+Statements; ComponentLink14Description: http://sigma.octopart.com:80/conflict_mineral_statement/Yageo-company-3.pdf?src-supplier=Compliance+Statements; ComponentLink15URL: http://sigma.octopart.com:80/rohs_statement/Yageo-company-2.pdf?src-supplier=Compliance+Statements; ComponentLink15Description: http://sigma.octopart.com:80/rohs_statement/Yageo-company-2.pdf?src-supplier=Compliance+Statements
R12 R14 R16-R18 = RES
U1 = ISL6236AIRZ: Soft Sw PWM Cntrlr 2-OUT Power Supply Controller 200KHz/300KHz/400KHz/500KHz 32-Pin QFN EP; Manufacturer: Renesas; Manufacturer Lifecycle Status: OBSOLETE; Efficiency: 97%; Frequency: 500kHz; Max Supply Voltage: 25V; Max Junction Temperature (Tj): 150°C; Max Output current: 3.3A; Min Input Voltage: 5.5V; Min Supply Voltage: 4.5V; Min Switching Frequency: 25kHz; Nominal Supply Voltage: 12V; Nominal Output Voltage: 1.05V; Number of Circuits: 1; Number of Outputs: 2; Output Current: 20A; Pitch: 500µm; Switching Frequency: 37kHz; Topology: Buck, Push-Pull; Supplier: DigiKey; Supplier Part Number: ISL6236AIRZ-ND; Manufacturer Part Number: ISL6236AIRZ; RoHS: Compliant; Category: Voltage Regulators - Switching; Stock: 709; Pricing: 1=7.16, 10=5.332, 25=4.8928, 100=4.417, 490=4.0622 (USD); Case/Package: QFN; Country of Origin: Taiwan; Export Control Classification Number (ECCN) Code: EAR99; Part Family: ISL6236A; Height: 900µm; Height - Seated (Max): 1mm; Harmonized Tariff Schedule (HTS) Code: 8542.39.00.60; Introduction Date: 2017-11-10; Lead Free: Lead Free; Length: 5mm; Lifecycle Status: Obsolete; LTB Date: 2025-09-04; LTD Date: 2026-03-04; Max Operating Temperature: 100°C; Max Switching Frequency: 500kHz; Min Operating Temperature: -40°C; MSL: 3; Mounting Technology: Surface Mount; Pins: 32; Number of Terminals: 32; Output Voltage: 5.5V; Radiation Hardening: No; REACH SVHC: Yes; Temperature Grade: Industrial; Terminal Pitch: 500µm; Width: 5mm; ComponentLink1URL: https://datasheet.octopart.com:443/ISL6236AIRZ-Renesas-datasheet-149187364.pdf?src-supplier=Integrated+Device+Technology; ComponentLink1Description: https://datasheet.octopart.com:443/ISL6236AIRZ-Renesas-datasheet-149187364.pdf?src-supplier=Integrated+Device+Technology; ComponentLink2URL: https://datasheet.octopart.com:443/ISL6236AIRZ-Renesas-datasheet-179182849.pdf?src-supplier=Integrated+Device+Technology; ComponentLink2Description: https://datasheet.octopart.com:443/ISL6236AIRZ-Renesas-datasheet-179182849.pdf?src-supplier=Integrated+Device+Technology; ComponentLink3URL: https://datasheet.octopart.com:443/ISL6236AIRZ-Renesas-datasheet-14388266.pdf?src-supplier=IHS; ComponentLink3Description: https://datasheet.octopart.com:443/ISL6236AIRZ-Renesas-datasheet-14388266.pdf?src-supplier=IHS; ComponentLink4URL: https://datasheet.octopart.com:443/ISL6236AIRZ-Renesas-datasheet-138160199.pdf?src-supplier=Future+Electronics; ComponentLink4Description: https://datasheet.octopart.com:443/ISL6236AIRZ-Renesas-datasheet-138160199.pdf?src-supplier=Future+Electronics; ComponentLink5URL: https://datasheet.octopart.com:443/ISL6236AIRZ-Intersil-datasheet-158443858.pdf?src-supplier=Augswan; ComponentLink5Description: https://datasheet.octopart.com:443/ISL6236AIRZ-Intersil-datasheet-158443858.pdf?src-supplier=Augswan; ComponentLink6URL: http://sigma.octopart.com:80/reach_statement/Renesas-company-45.pdf?src-supplier=Compliance+Statements; ComponentLink6Description: http://sigma.octopart.com:80/reach_statement/Renesas-company-45.pdf?src-supplier=Compliance+Statements; ComponentLink7URL: http://sigma.octopart.com:80/conflict_mineral_statement/Renesas-company-44.pdf?src-supplier=Compliance+Statements; ComponentLink7Description: http://sigma.octopart.com:80/conflict_mineral_statement/Renesas-company-44.pdf?src-supplier=Compliance+Statements